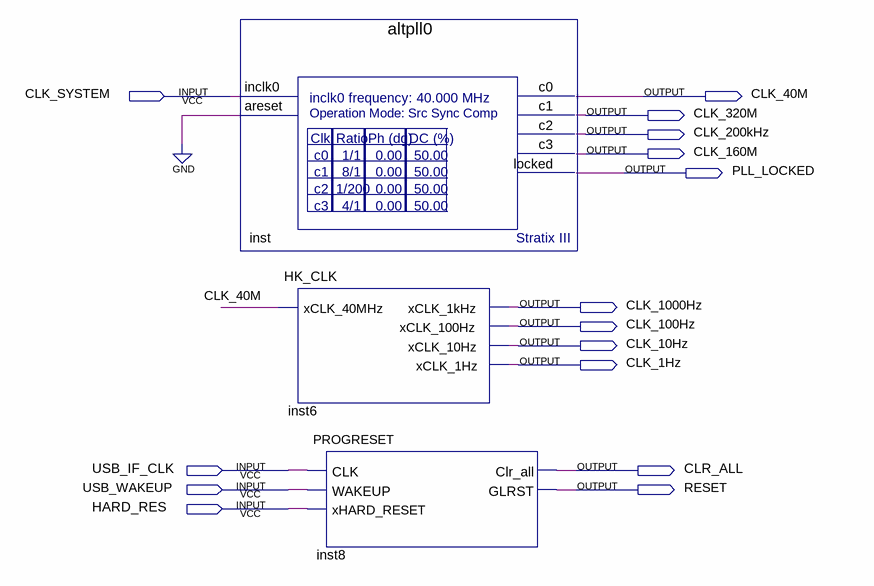
[diagram p0: schematic sheet]
// Quartus schematic CLK_main.bdf as structural Verilog: 3 symbols, 15 pins
module CLK_main (
  input  CLK_SYSTEM,
  input  USB_IF_CLK,
  input  USB_WAKEUP,
  input  HARD_RES,
  output CLK_40M,
  output CLK_320M,
  output CLK_200kHz,
  output CLK_160M,
  output PLL_LOCKED,
  output CLK_1000Hz,
  output CLK_100Hz,
  output CLK_10Hz,
  output CLK_1Hz,
  output CLR_ALL,
  output RESET
);

  altpll0 inst (
    .inclk0(CLK_SYSTEM), .areset(1'b0), .c0(CLK_40M), .c1(CLK_320M), .c2(CLK_200kHz), .c3(CLK_160M),
    .locked(PLL_LOCKED));
  HK_CLK inst6 (
    .xCLK_40MHz(CLK_40M), .xCLK_1kHz(CLK_1000Hz), .xCLK_100Hz(CLK_100Hz), .xCLK_10Hz(CLK_10Hz),
    .xCLK_1Hz(CLK_1Hz));
  PROGRESET inst8 (.CLK(USB_IF_CLK), .WAKEUP(USB_WAKEUP), .xHARD_RESET(HARD_RES), .Clr_all(CLR_ALL), .GLRST(RESET));
endmodule
